# Altium project OD12_LCD.PrjPcb
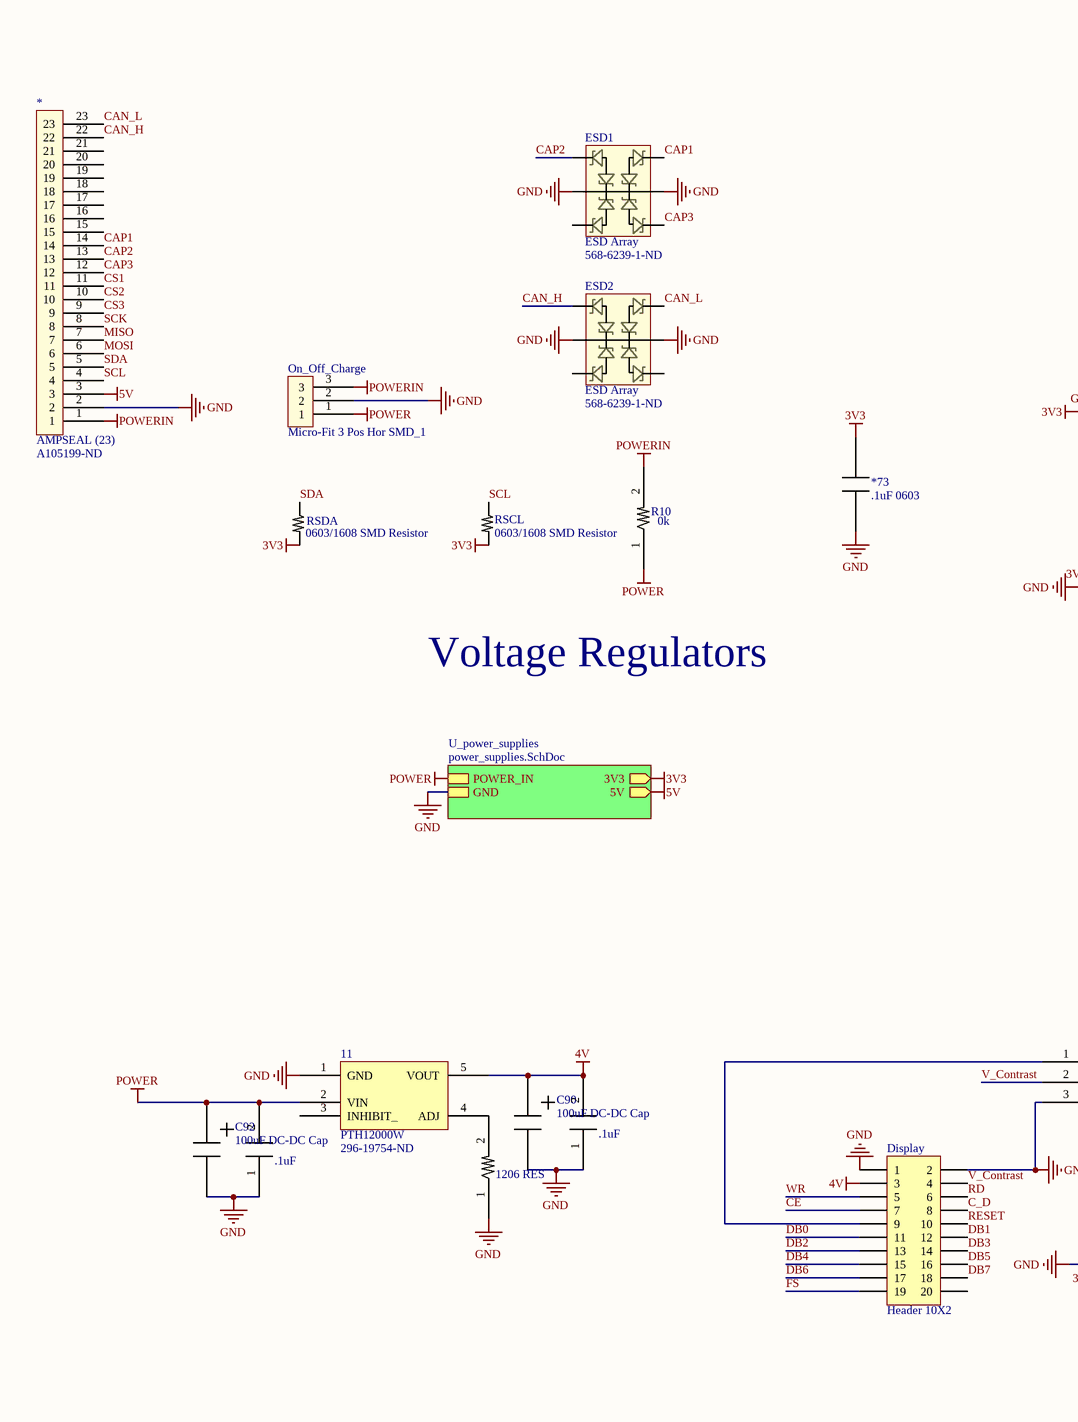
[diagram p0: OD12_LCD__Layout.SchDoc, left]
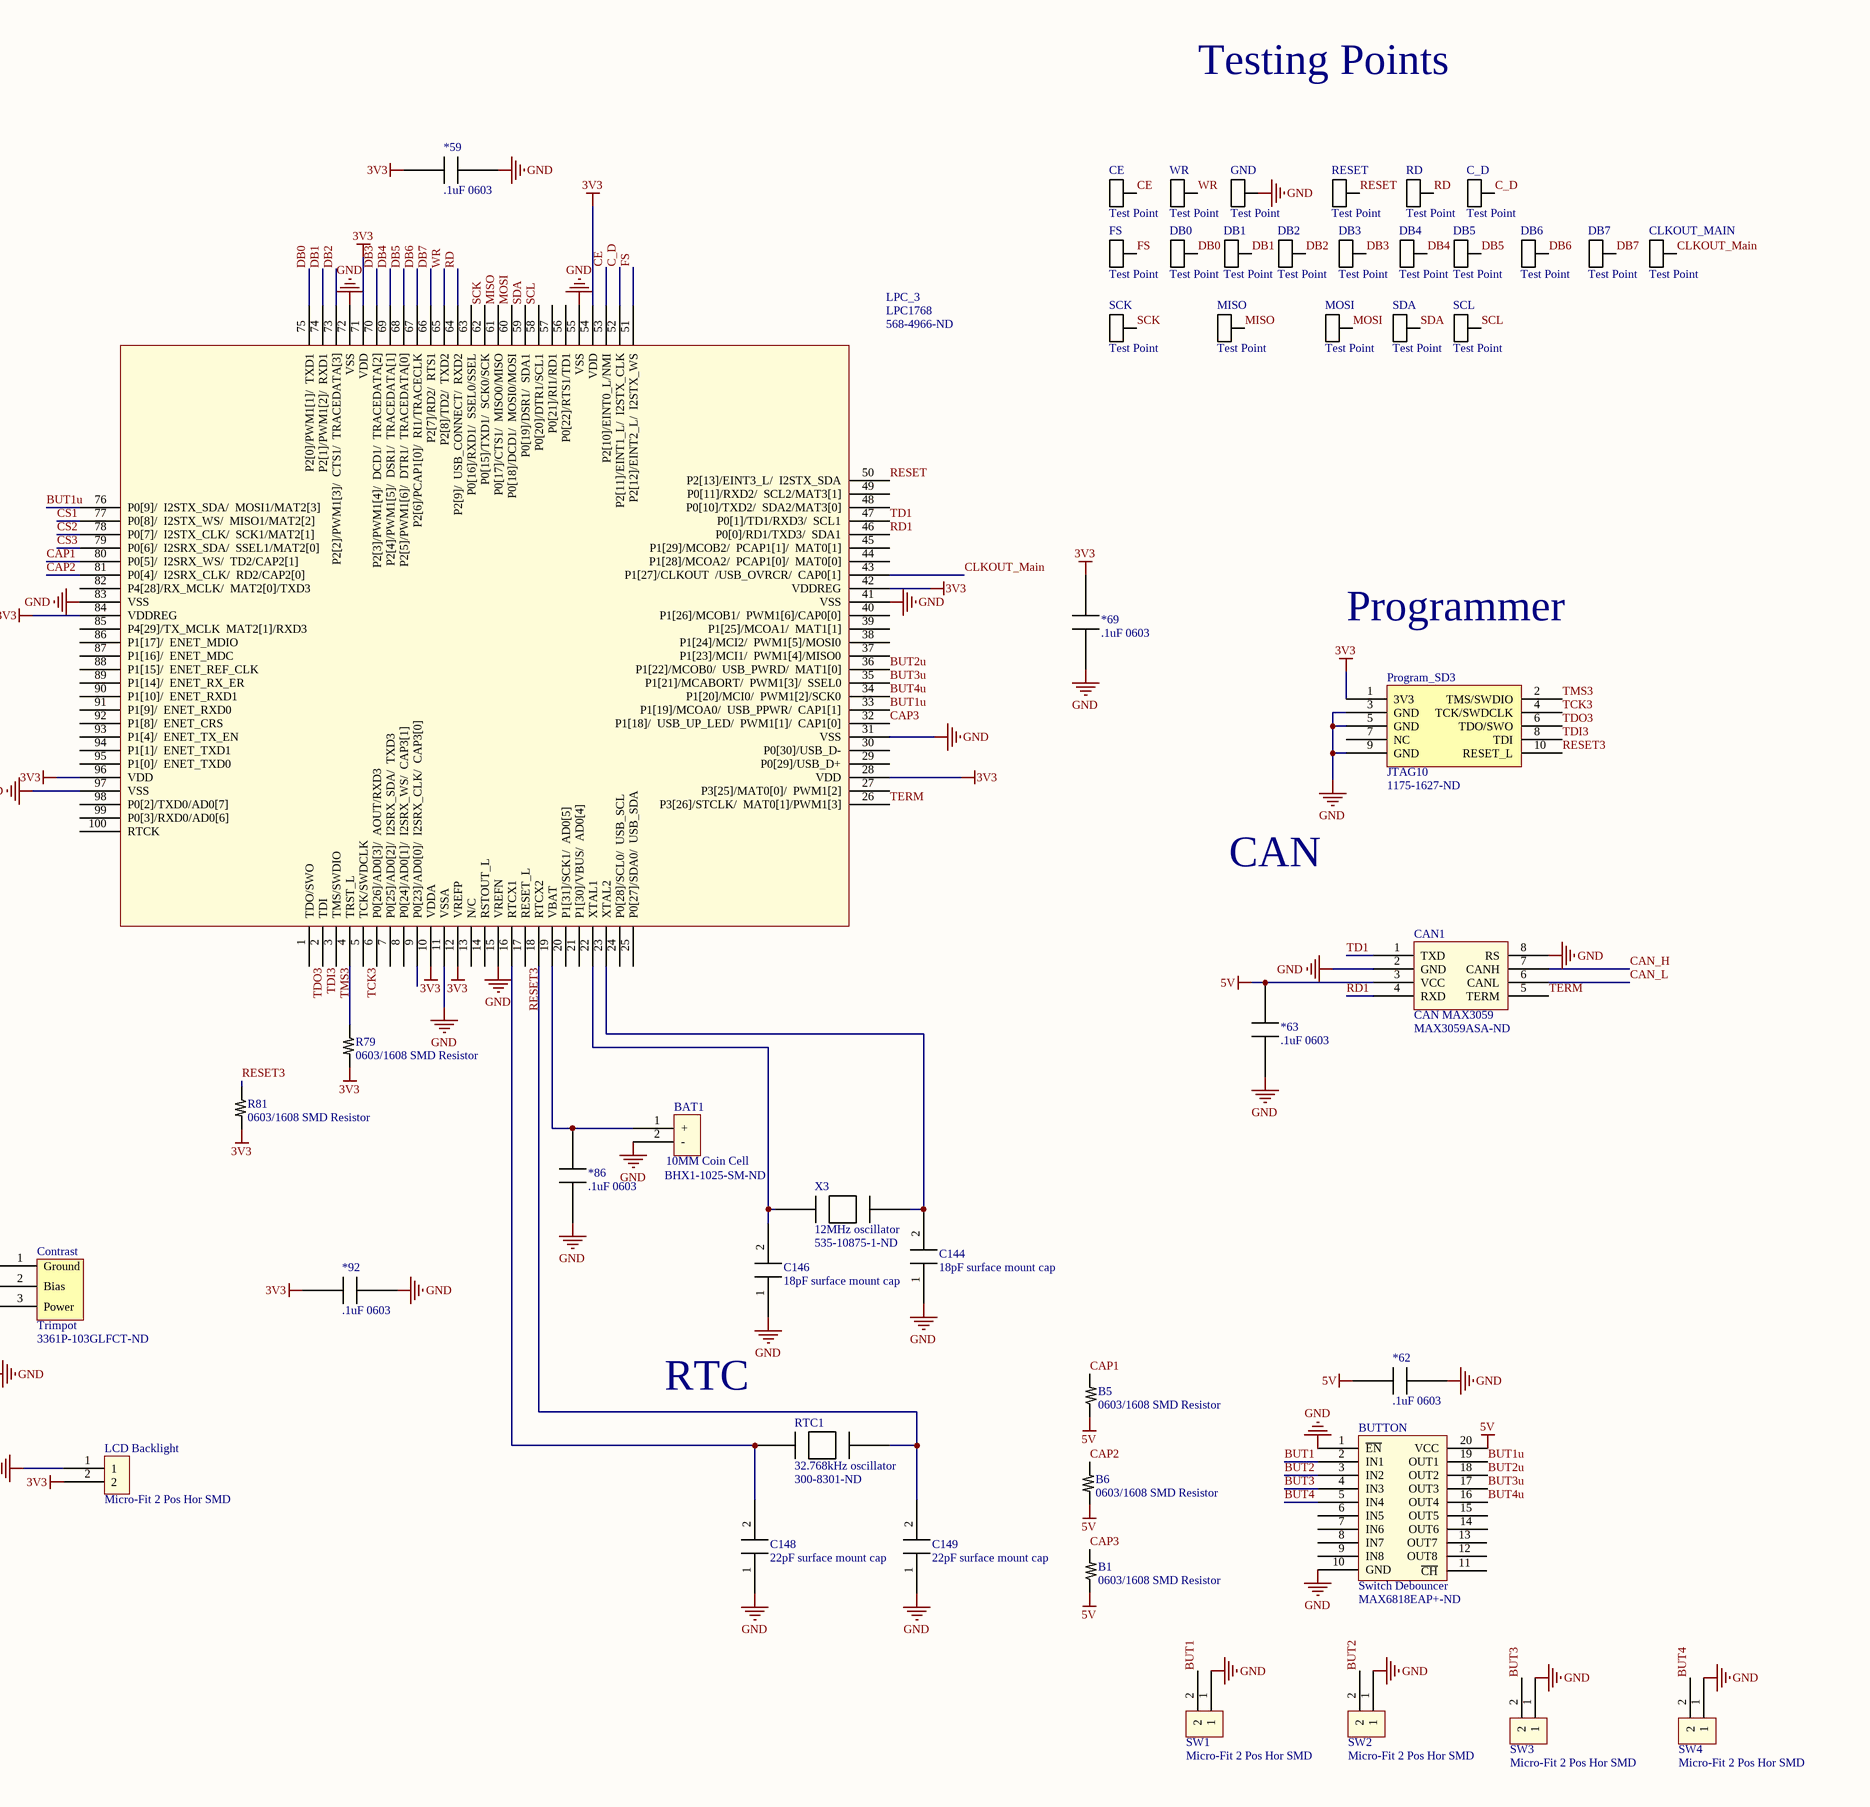
[diagram p1: OD12_LCD__Layout.SchDoc, right]
2 sheets, 78 parts. Net scope: hierarchical (ports join the sheet entries above them; power ports are global).
Board file: OD12_LCD__Layout.PcbDoc
Sheets:
  OD12_LCD__Layout.SchDoc
    U_power_supplies = power_supplies.SchDoc

## Sheet OD12_LCD__Layout.SchDoc
size D

### Parts
11  PTH12000W  Supplier Part Number 1: 296-19754-ND  [PowerModule]
*  AMPSEAL (23)  Supplier Part Number 1: A105199-ND  [AMPSEAL (23) HOR]
*59  .1uF 0603  [0603/1608 SMD Resistor]
*62  .1uF 0603  [0603/1608 SMD Resistor]
*63  .1uF 0603  [0603/1608 SMD Resistor]
*69  .1uF 0603  [0603/1608 SMD Resistor]
*73  .1uF 0603  [0603/1608 SMD Resistor]
*86  .1uF 0603  [0603/1608 SMD Resistor]
*92  .1uF 0603  [0603/1608 SMD Resistor]
B1  0603/1608 SMD Resistor  [0603/1608 SMD Resistor]
B5  0603/1608 SMD Resistor  [0603/1608 SMD Resistor]
B6  0603/1608 SMD Resistor  [0603/1608 SMD Resistor]
BAT1  10MM Coin Cell  Supplier Part Number 1: BHX1-1025-SM-ND  [10MM Coin Cell]
BUTTON  Switch Debouncer  Supplier Part Number 1: MAX6818EAP+-ND  [SOP65P780X199-20N]
C90  100uF DC-DC Cap  [100uF DC-DC Cap]
C91  .1uF  [1206]
C92  100uF DC-DC Cap  [100uF DC-DC Cap]
C93  .1uF  [1206]
C144  18pF surface mount cap  [1206]
C146  18pF surface mount cap  [1206]
C148  22pF surface mount cap  [1206]
C149  22pF surface mount cap  [1206]
C_D  Test Point  [Test Point]
CAN1  CAN MAX3059  Supplier Part Number 1: MAX3059ASA-ND  [TJA1040]
CE  Test Point  [Test Point]
CLKOUT_MAIN  Test Point  [Test Point]
Contrast  Trimpot  Supplier Part Number 1: 3361P-103GLFCT-ND  [TrimPot]
DB0  Test Point  [Test Point]
DB1  Test Point  [Test Point]
DB2  Test Point  [Test Point]
DB3  Test Point  [Test Point]
DB4  Test Point  [Test Point]
DB5  Test Point  [Test Point]
DB6  Test Point  [Test Point]
DB7  Test Point  [Test Point]
Display  Header 10X2  [HDR2X10]
ESD1  ESD Array  Supplier Part Number 1: 568-6239-1-ND  [ESD_Array_BZA408B]
ESD2  ESD Array  Supplier Part Number 1: 568-6239-1-ND  [ESD_Array_BZA408B]
FS  Test Point  [Test Point]
GND  Test Point  [Test Point]
LCD_Backlight  Micro-Fit 2 Pos Hor SMD  [Micro-fit 2 Pos Hor SMD - duplicate]
LPC_3  LPC1768  Supplier Part Number 1: 568-4966-ND  [LPC1768]
MISO  Test Point  [Test Point]
MOSI  Test Point  [Test Point]
On_Off_Charge  Micro-Fit 3 Pos Hor SMD_1  [Micro-fit 3 Pos Hor SMD - duplicate1]
Program_SD3  JTAG10  Supplier Part Number 1: 1175-1627-ND  [JTAG10 Polarity]
R10  0k  [1206 surface mount resistor]
R47  1206 RES  [1206]
R79  0603/1608 SMD Resistor  [0603/1608 SMD Resistor]
R81  0603/1608 SMD Resistor  [0603/1608 SMD Resistor]
RD  Test Point  [Test Point]
RESET  Test Point  [Test Point]
RSCL  0603/1608 SMD Resistor  [0603/1608 SMD Resistor]
RSDA  0603/1608 SMD Resistor  [0603/1608 SMD Resistor]
RTC1  32.768kHz oscillator  Supplier Part Number 1: 300-8301-ND  [32.768kHz Oscillator]
SCK  Test Point  [Test Point]
SCL  Test Point  [Test Point]
SDA  Test Point  [Test Point]
SW1  Micro-Fit 2 Pos Hor SMD  [Micro-fit 2 Pos Hor SMD - duplicate]
SW2  Micro-Fit 2 Pos Hor SMD  [Micro-fit 2 Pos Hor SMD - duplicate]
SW3  Micro-Fit 2 Pos Hor SMD  [Micro-fit 2 Pos Hor SMD - duplicate]
SW4  Micro-Fit 2 Pos Hor SMD  [Micro-fit 2 Pos Hor SMD - duplicate]
WR  Test Point  [Test Point]
X3  12MHz oscillator  Supplier Part Number 1: 535-10875-1-ND  [12MHZ Oscillator]

### Sub-sheets
U_power_supplies = power_supplies.SchDoc: 3V3 (out), POWER_IN, 5V (out), GND

### Nets
3V3: *59.2 *69.1 *73.2 *92.2 LCD_Backlight.2 LPC_3.10(VDDA) LPC_3.12(VREFP) LPC_3.28(VDD) LPC_3.42(VDDREG) LPC_3.54(VDD) LPC_3.71(VDD) LPC_3.84(VDDREG) LPC_3.96(VDD) Program_SD3.1(3V3) R79.1 R81.1 RSCL.1 RSDA.1 ; sheet U_power_supplies/3V3
4V: 11.5(VOUT) C90.1(+) C91.2 Display.3
5V: *.3 *62.2 *63.2 B1.2 B5.2 B6.1 BUTTON.20(VCC) CAN1.3(VCC) ; sheet U_power_supplies/5V
GND: 11.1(GND) *.2 *59.1 *62.1 *63.1 *69.2 *73.1 *86.2 *92.1 BAT1.2(-) BUTTON.1(~{EN}) BUTTON.10(GND) C90.2(-) C91.1 C92.2(-) C93.1 C144.1 C146.1 C148.1 C149.1 CAN1.2(GND) CAN1.8(RS) Contrast.3(Power) Display.1 Display.2 ESD1.2 ESD1.5 ESD2.2 ESD2.5 GND.1 LCD_Backlight.1 LPC_3.11(VSSA) LPC_3.15(VREFN) LPC_3.31(VSS) LPC_3.41(VSS) LPC_3.55(VSS) LPC_3.72(VSS) LPC_3.83(VSS) LPC_3.97(VSS) On_Off_Charge.2 Program_SD3.3(GND) Program_SD3.5(GND) Program_SD3.9(GND) R47.1 SW1.1 SW2.1 SW3.1 SW4.1 ; sheet U_power_supplies/GND
POWER: 11.2(VIN) C92.1(+) C93.2 On_Off_Charge.1 R10.1 ; sheet U_power_supplies/POWER_IN
POWERIN: *.1 On_Off_Charge.3 R10.2
BUT1: BUTTON.2(IN1) SW1.2
BUT1u: BUTTON.19(OUT1) LPC_3.33(P1[19]/MCOA0/__USB_PPWR/__CAP1[1]) LPC_3.76(P0[9]/__I2STX_SDA/__MOSI1/MAT2[3])
BUT2: BUTTON.3(IN2) SW2.2
BUT2u: BUTTON.18(OUT2) LPC_3.36(P1[22]/MCOB0/__USB_PWRD/__MAT1[0])
BUT3: BUTTON.4(IN3) SW3.2
BUT3u: BUTTON.17(OUT3) LPC_3.35(P1[21]/MCABORT/__PWM1[3]/__SSEL0)
BUT4: BUTTON.5(IN4) SW4.2
BUT4u: BUTTON.16(OUT4) LPC_3.34(P1[20]/MCI0/__PWM1[2]/SCK0)
C_D: C_D.1 Display.8 LPC_3.52(P2[11]/EINT1_L/__I2STX_CLK)
CAN_H: *.22 CAN1.7(CANH) ESD2.1
CAN_L: *.23 CAN1.6(CANL) ESD2.6
CAP1: *.14 B5.1 ESD1.6 LPC_3.80(P0[5]/__I2SRX_WS/__TD2/CAP2[1])
CAP2: *.13 B6.2 ESD1.1 LPC_3.81(P0[4]/__I2SRX_CLK/__RD2/CAP2[0])
CAP3: *.12 B1.1 ESD1.4 LPC_3.32(P1[18]/__USB_UP_LED/__PWM1[1]/__CAP1[0])
CE: CE.1 Display.7 LPC_3.53(P2[10]/EINT0_L/NMI)
CLKOUT_Main: CLKOUT_MAIN.1 LPC_3.43(P1[27]/CLKOUT__/USB_OVRCR/__CAP0[1])
CS1: *.11 LPC_3.77(P0[8]/__I2STX_WS/__MISO1/MAT2[2])
CS2: *.10 LPC_3.78(P0[7]/__I2STX_CLK/__SCK1/MAT2[1])
CS3: *.9 LPC_3.79(P0[6]/__I2SRX_SDA/__SSEL1/MAT2[0])
DB0: DB0.1 Display.11 LPC_3.75(P2[0]/PWM1[1]/__TXD1)
DB1: DB1.1 Display.12 LPC_3.74(P2[1]/PWM1[2]/__RXD1)
DB2: DB2.1 Display.13 LPC_3.73(P2[2]/PWM1[3]/__CTS1/__TRACEDATA[3])
DB3: DB3.1 Display.14 LPC_3.70(P2[3]/PWM1[4]/__DCD1/__TRACEDATA[2])
DB4: DB4.1 Display.15 LPC_3.69(P2[4]/PWM1[5]/__DSR1/__TRACEDATA[1])
DB5: DB5.1 Display.16 LPC_3.68(P2[5]/PWM1[6]/__DTR1/__TRACEDATA[0])
DB6: DB6.1 Display.17 LPC_3.67(P2[6]/PCAP1[0]/__RI1/TRACECLK)
DB7: DB7.1 Display.18 LPC_3.66(P2[7]/RD2/__RTS1)
FS: Display.19 FS.1 LPC_3.51(P2[12]/EINT2_L/__I2STX_WS)
MISO: *.7 LPC_3.61(P0[17]/CTS1/__MISO0/MISO) MISO.1
MOSI: *.6 LPC_3.60(P0[18]/DCD1/__MOSI0/MOSI) MOSI.1
RD: Display.6 LPC_3.64(P2[9]/__USB_CONNECT/__RXD2) RD.1
RD1: CAN1.4(RXD) LPC_3.46(P0[0]/RD1/TXD3/__SDA1)
RESET: Display.10 LPC_3.50(P2[13]/EINT3_L/__I2STX_SDA) RESET.1
RESET3: LPC_3.17(RESET_L) Program_SD3.10(RESET_L) R81.2
SCK: *.8 LPC_3.62(P0[15]/TXD1/__SCK0/SCK) SCK.1
SCL: *.4 LPC_3.58(P0[20]/DTR1/SCL1) RSCL.2 SCL.1
SDA: *.5 LPC_3.59(P0[19]/DSR1/__SDA1) RSDA.2 SDA.1
TCK3: LPC_3.5(TCK/SWDCLK) Program_SD3.4(TCK/SWDCLK)
TD1: CAN1.1(TXD) LPC_3.47(P0[1]/TD1/RXD3/__SCL1)
TDI3: LPC_3.2(TDI) Program_SD3.8(TDI)
TDO3: LPC_3.1(TDO/SWO) Program_SD3.6(TDO/SWO)
TERM: CAN1.5(TERM) LPC_3.26(P3[26]/STCLK/__MAT0[1]/PWM1[3])
TMS3: LPC_3.3(TMS/SWDIO) Program_SD3.2(TMS/SWDIO)
V_Contrast: Contrast.2(Bias) Display.4
WR: Display.5 LPC_3.65(P2[8]/TD2/__TXD2) WR.1
Net11_4: 11.4(ADJ) R47.2
Net*86_1: *86.1 BAT1.1(+) LPC_3.19(VBAT)
NetC144_2: C144.2 LPC_3.23(XTAL2) X3.1
NetC146_2: C146.2 LPC_3.22(XTAL1) X3.2
NetC148_2: C148.2 LPC_3.16(RTCX1) RTC1.1
NetC149_2: C149.2 LPC_3.18(RTCX2) RTC1.2
NetContrast_1: Contrast.1(Ground) Display.9
NetLPC_3_4: LPC_3.4(TRST_L) R79.2

Not connected (* = marked no-connect by the designer): 11 3(INHIBIT_); * 15 16 17 18 19 20 21; BUTTON 6(IN5) 7(IN6) 8(IN7) 9(IN8) 11(~{CH}) 12(OUT8) 13(OUT7) 14(OUT6) 15(OUT5); Display 20; ESD1 3; ESD2 3 4; LPC_3 6(P0[26]/AD0[3]/__AOUT/RXD3) 7(P0[25]/AD0[2]/__I2SRX_SDA/__TXD3) 8(P0[24]/AD0[1]/__I2SRX_WS/__CAP3[1]) 9(P0[23]/AD0[0]/__I2SRX_CLK/__CAP3[0]) 13(N/C) 14(RSTOUT_L) 20(P1[31]/SCK1/__AD0[5]) 21(P1[30]/VBUS/__AD0[4]) 24(P0[28]/SCL0/__USB_SCL) 25(P0[27]/SDA0/__USB_SDA) 27(P3[25]/MAT0[0]/__PWM1[2]) 29(P0[29]/USB_D+) 30(P0[30]/USB_D-) 37(P1[23]/MCI1/__PWM1[4]/MISO0) 38(P1[24]/MCI2/__PWM1[5]/MOSI0) 39(P1[25]/MCOA1/__MAT1[1]) 40(P1[26]/MCOB1/__PWM1[6]/CAP0[0]) 44(P1[28]/MCOA2/__PCAP1[0]/__MAT0[0]) 45(P1[29]/MCOB2/__PCAP1[1]/__MAT0[1]) 48(P0[10]/TXD2/__SDA2/MAT3[0]) 49(P0[11]/RXD2/__SCL2/MAT3[1]) 56(P0[22]/RTS1/TD1) 57(P0[21]/RI1/RD1) 63(P0[16]/RXD1/__SSEL0/SSEL) 82(P4[28]/RX_MCLK/__MAT2[0]/TXD3) 85(P4[29]/TX_MCLK__MAT2[1]/RXD3) 86(P1[17]/__ENET_MDIO) 87(P1[16]/__ENET_MDC) 88(P1[15]/__ENET_REF_CLK) 89(P1[14]/__ENET_RX_ER) 90(P1[10]/__ENET_RXD1) 91(P1[9]/__ENET_RXD0) 92(P1[8]/__ENET_CRS) 93(P1[4]/__ENET_TX_EN) 94(P1[1]/__ENET_TXD1) 95(P1[0]/__ENET_TXD0) 98(P0[2]/TXD0/AD0[7]) 99(P0[3]/RXD0/AD0[6]) 100(RTCK); Program_SD3 7(NC)

### Notes on the sheet
- Testing Points
- Programmer
- Voltage Regulators
- CAN
- RTC

### Library data of the parts
11 = PTH12000W: Adj 6A 12Vin Power Module; ComponentLink1URL: http://www.ti.com/lit/ds/symlink/pth12000l.pdf; ComponentLink1Description: http://www.ti.com/lit/ds/symlink/pth12000l.pdf; Supplier 1: Digi-Key
*59 *62 *63 *69 *73 *86 *92 = 0603 Cap
C91 C93 = 1206 CAP: .1 uF decoupling caps.  you probably want this for your project; ComponentLink1Description: Datasheet for .1 uF Capacitor; ComponentLink1URL: http://www.kemet.com/kemet/web/homepage/kechome.nsf/vapubfiles/F3102_X7R.pdf/$file/F3102_X7R.pdf; Supplier 1: Digi-Key; Supplier Part Number 1: 311-1161-1-ND
C144 C146 = 18pF surface mount cap: 1206 cap for loading a crystal oscillator
C148 C149 = 20pF surface mount cap: 1206 cap for loading the crystal oscillator
Display = Header 10X2: Header, 10-Pin, Dual row; LatestRevisionDate: 17-Jul-2002; LatestRevisionNote: Re-released for DXP Platform.; Publisher: Altium Limited
ESD1 ESD2 = ESD Array: BZA408B,115; Supplier 1: Digi-Key
LPC_3 = LPC1768: 100 pin ARM microcontroller; Supplier 1: Digi-Key
Program_SD3 = JTAG10: 3220-10-0100-00; Supplier 1: Digi-Key
R10 = Blank Resistor Surface mount 1206: Blank surface mount resistor.; ComponentLink1URL: http://industrial.panasonic.com/www-cgi/jvcr13pz.cgi?E+PZ+3+AOA0001+ERJ8GEYJ103V+7+WW; ComponentLink1Description: Datasheet for 10k Resistor
R47 = 1206 RES: 0 ohm surface mount resistor.; ComponentLink1URL: http://industrial.panasonic.com/www-cgi/jvcr13pz.cgi?E+PZ+3+AOA0001+ERJ8GEYJ103V+7+WW; ComponentLink1Description: Datasheet for 10k Resistor
RTC1 = 32.768kHz: 32.768kHz surface mount oscillator; Supplier 1: Digi-Key
X3 = 12MHz oscillator: 12MHz surface mount oscillator; Supplier 1: Digi-Key
* = AMPSEAL (23): Supplier 1: Digi-Key
BAT1 = 10MM Coin Cell: Supplier 1: Digi-Key
BUTTON = Switch Debouncer: Supplier 1: Digi-Key
C90 C92 = 100uF DC-DC Cap: Supplier 1: Digi-Key; ComponentLink1URL: http://www.nichicon.co.jp/english/products/pdf/2013fpcap_catalog_r7.pdf; ComponentLink1Description: http://www.nichicon.co.jp/english/products/pdf/2013fpcap_catalog_r7.pdf; Supplier Part Number 1: 493-3716-ND
C_D CE CLKOUT_MAIN DB0-DB7 FS GND MISO MOSI RD RESET SCK SCL SDA WR = Test Point: Supplier 1: Digi-Key; Supplier Part Number 1: 5019KCT-ND
CAN1 = CAN MAX3059: Supplier 1: Digi-Key
Contrast = Trimpot: Supplier 1: Digi-Key

## Sheet power_supplies.SchDoc
size A
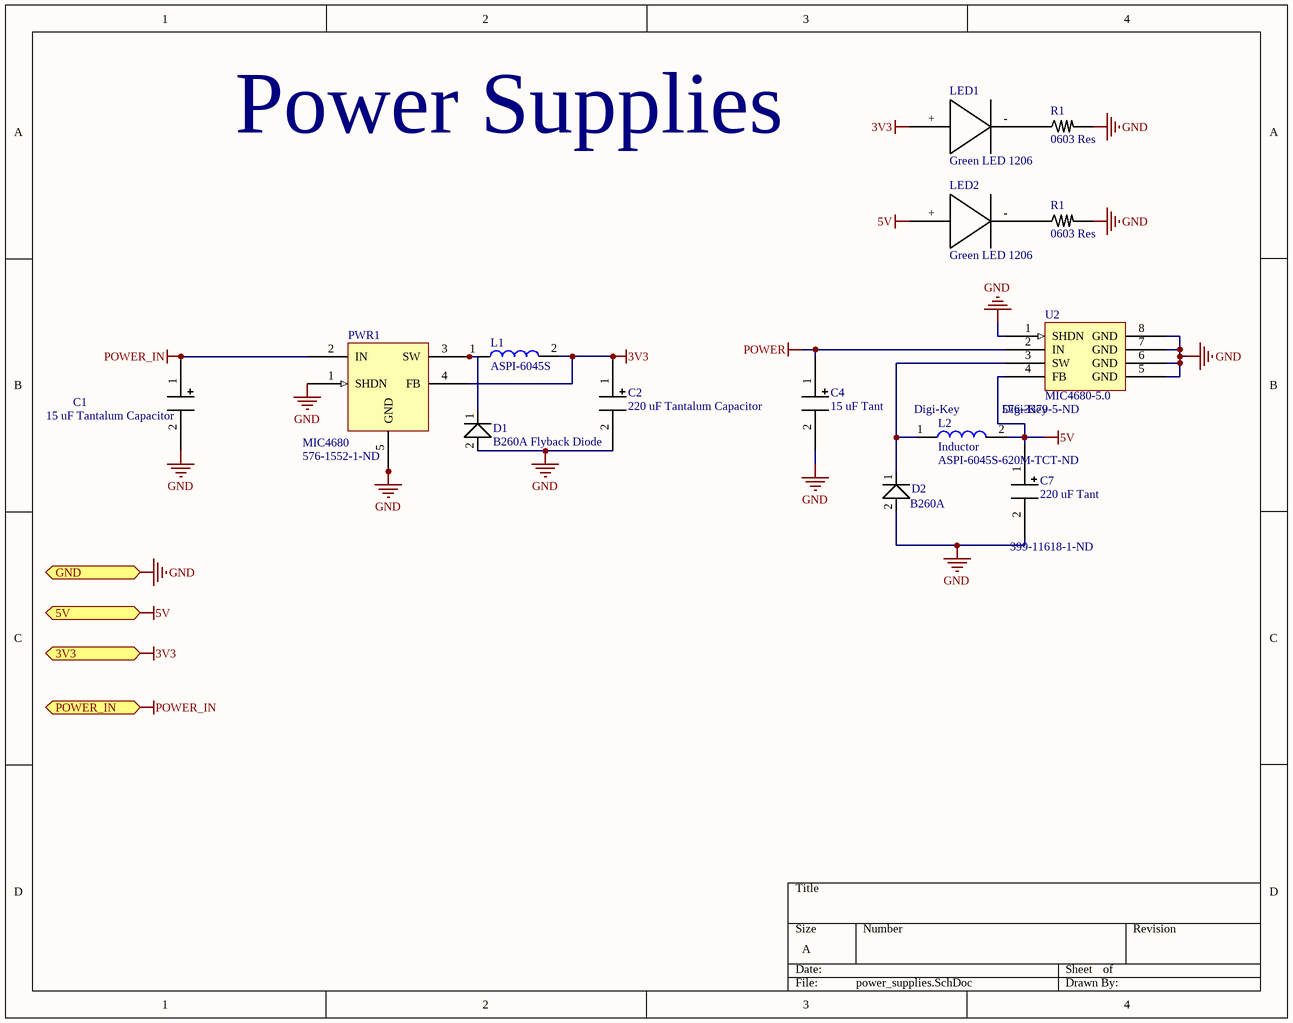
[diagram p2: power_supplies.SchDoc]

### Parts
(Parts that share a designator on the sheet are numbered #1, #2 ... from top to bottom, then left to right.)
C1  15 uF Tantalum Capacitor  [1206 (POLAR)]
C2  220 uF Tantalum Capacitor  [1206 (POLAR)]
C4  15 uF Tant  [1206 (POLAR)]
C7  220 uF Tant  Supplier Part Number 1: 399-11618-1-ND  [2312 Surface Mount (POLAR)]
D1  B260A Flyback Diode  [DO-214AC]
D2  B260A  [DO-214AC]
L1  ASPI-6045S  [ASPI-6045]
L2  Inductor  Supplier 1: Digi-Key  Supplier Part Number 1: ASPI-6045S-620M-TCT-ND  [ASPI-6045]
LED1  Green LED 1206  [Cathode Mark 1206 led footprint]
LED2  Green LED 1206  [Cathode Mark 1206 led footprint]
PWR1  MIC4680  Supplier Part Number 1: 576-1552-1-ND  [TJA1040]
R1#1  0603 Res  [0603/1608 SMD Resistor]
R1#2  0603 Res  [0603/1608 SMD Resistor]
U2  MIC4680-5.0  Supplier 1: Digi-Key  Supplier Part Number 1: 576-3379-5-ND  [SOIC8]

### Ports
3V3 (out), 5V (out), GND, POWER_IN

### Nets
3V3: C2.1 L1.2 LED1.+ PWR1.4(FB) ; port 3V3
5V: C7.1 L2.2 LED2.+ U2.4(FB) ; port 5V
GND: C1.2 C2.2 C4.2 C7.2 D1.2 D2.2 PWR1.1(SHDN) PWR1.5(GND) PWR1.6 PWR1.7 PWR1.8 R1#1.2 R1#2.2 U2.1(SHDN) U2.5(GND) U2.6(GND) U2.7(GND) U2.8(GND) ; port GND
POWER: C1.1 C4.1 PWR1.2(IN) U2.2(IN) ; port POWER_IN  [also labelled POWER_IN]
NetD1_1: D1.1 L1.1 PWR1.3(SW)
NetD2_1: D2.1 L2.1 U2.3(SW)
NetLED1_-: LED1.- R1#1.1
NetLED2_-: LED2.- R1#2.1

### Notes on the sheet
- Power Supplies

### Library data of the parts
C1 C2 C4 = 15 uF Tantalum Capacitor: 1206 Surface Mount Capacitor
C7 = 220 uF Tantalum Capacitor: 2312 Surface Mount Capacitor; Supplier 1: Digi-Key
D2 = B260A Flyback Diode
L1 = ASPI-6045S: 68 uH 1.2A surface mount inductor
LED1 LED2 = 1206 Green LED: Green surface mount LED
PWR1 = MIC4680: 3.3V Fixed Switching Regulator 1A; Supplier 1: Digi-Key
U2 = MIC4680-5.0: 5V Fixed Switching Regulator 1A
L2 = Inductor: Supplier 2: Digi-Key; Supplier 3: Digi-Key; Supplier Part Number 2: 308-1571-1-ND; Supplier Part Number 3: SRP7030-4R7FMCT-ND

## Nets that join several sheets
3V3: OD12_LCD__Layout (18 pins), power_supplies (C2.1 L1.2 LED1.+ PWR1.4)
5V: OD12_LCD__Layout (8 pins), power_supplies (C7.1 L2.2 LED2.+ U2.4)
GND: OD12_LCD__Layout (48 pins), power_supplies (18 pins)
POWER: OD12_LCD__Layout (5 pins), power_supplies (C1.1 C4.1 PWR1.2 U2.2)